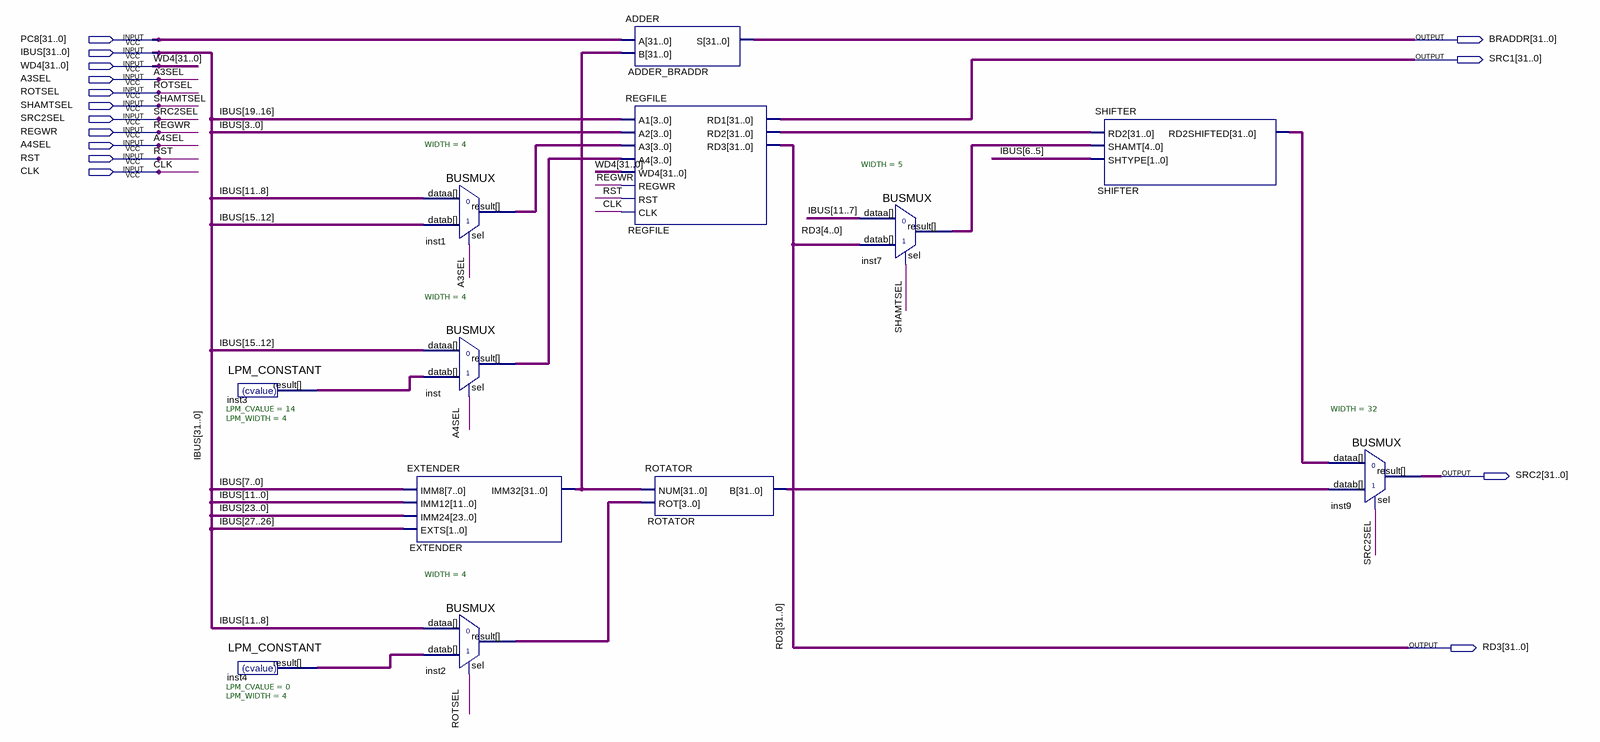
[diagram p0: schematic sheet]
// Quartus schematic decode.bdf as structural Verilog: 12 symbols, 15 pins
module decode (
  input  [31:0] PC8,
  input  [31:0] IBUS,
  input  [31:0] WD4,
  input  A3SEL,
  input  ROTSEL,
  input  SHAMTSEL,
  input  SRC2SEL,
  input  REGWR,
  input  A4SEL,
  input  RST,
  input  CLK,
  output [31:0] BRADDR,
  output [31:0] SRC1,
  output [31:0] SRC2,
  output [31:0] RD3
);

  wire [3:0] inst1_result, inst2_result, inst3_result, inst4_result, inst_result;
  wire [4:0] inst7_result;
  wire [31:0] EXTENDER_imm32, REGFILE_rd2, ROTATOR_b, SHIFTER_rd2shifted;

  LPM_CONSTANT #(.LPM_CVALUE(14), .LPM_WIDTH(4)) inst3 (.result(inst3_result));
  LPM_CONSTANT #(.LPM_CVALUE(0), .LPM_WIDTH(4)) inst4 (.result(inst4_result));
  EXTENDER EXTENDER (
    .IMM8(IBUS[7:0]), .IMM12(IBUS[11:0]), .IMM24(IBUS[23:0]), .EXTS(IBUS[27:26]), .IMM32(EXTENDER_imm32));
  BUSMUX #(.WIDTH(4)) inst1 (.datab(IBUS[15:12]), .sel(A3SEL), .dataa(IBUS[11:8]), .result(inst1_result));
  BUSMUX #(.WIDTH(4)) inst (.datab(inst3_result), .sel(A4SEL), .dataa(IBUS[15:12]), .result(inst_result));
  BUSMUX #(.WIDTH(4)) inst2 (.datab(inst4_result), .sel(ROTSEL), .dataa(IBUS[11:8]), .result(inst2_result));
  ADDER ADDER_BRADDR (.A(PC8), .B(EXTENDER_imm32), .S(BRADDR));
  REGFILE REGFILE (
    .A1(IBUS[19:16]), .A2(IBUS[3:0]), .A3(inst1_result), .A4(inst_result), .WD4(WD4), .REGWR(REGWR),
    .RST(RST), .CLK(CLK), .RD1(SRC1), .RD2(REGFILE_rd2), .RD3(RD3));
  ROTATOR ROTATOR (.NUM(EXTENDER_imm32), .ROT(inst2_result), .B(ROTATOR_b));
  BUSMUX #(.WIDTH(5)) inst7 (.datab(RD3[4:0]), .sel(SHAMTSEL), .dataa(IBUS[11:7]), .result(inst7_result));
  SHIFTER SHIFTER (.RD2(REGFILE_rd2), .SHAMT(inst7_result), .SHTYPE(IBUS[6:5]), .RD2SHIFTED(SHIFTER_rd2shifted));
  BUSMUX #(.WIDTH(32)) inst9 (.datab(ROTATOR_b), .sel(SRC2SEL), .dataa(SHIFTER_rd2shifted), .result(SRC2));
endmodule
